# Altium schematic sheet +5V_3V3_DIGITAL.SchDoc
size B
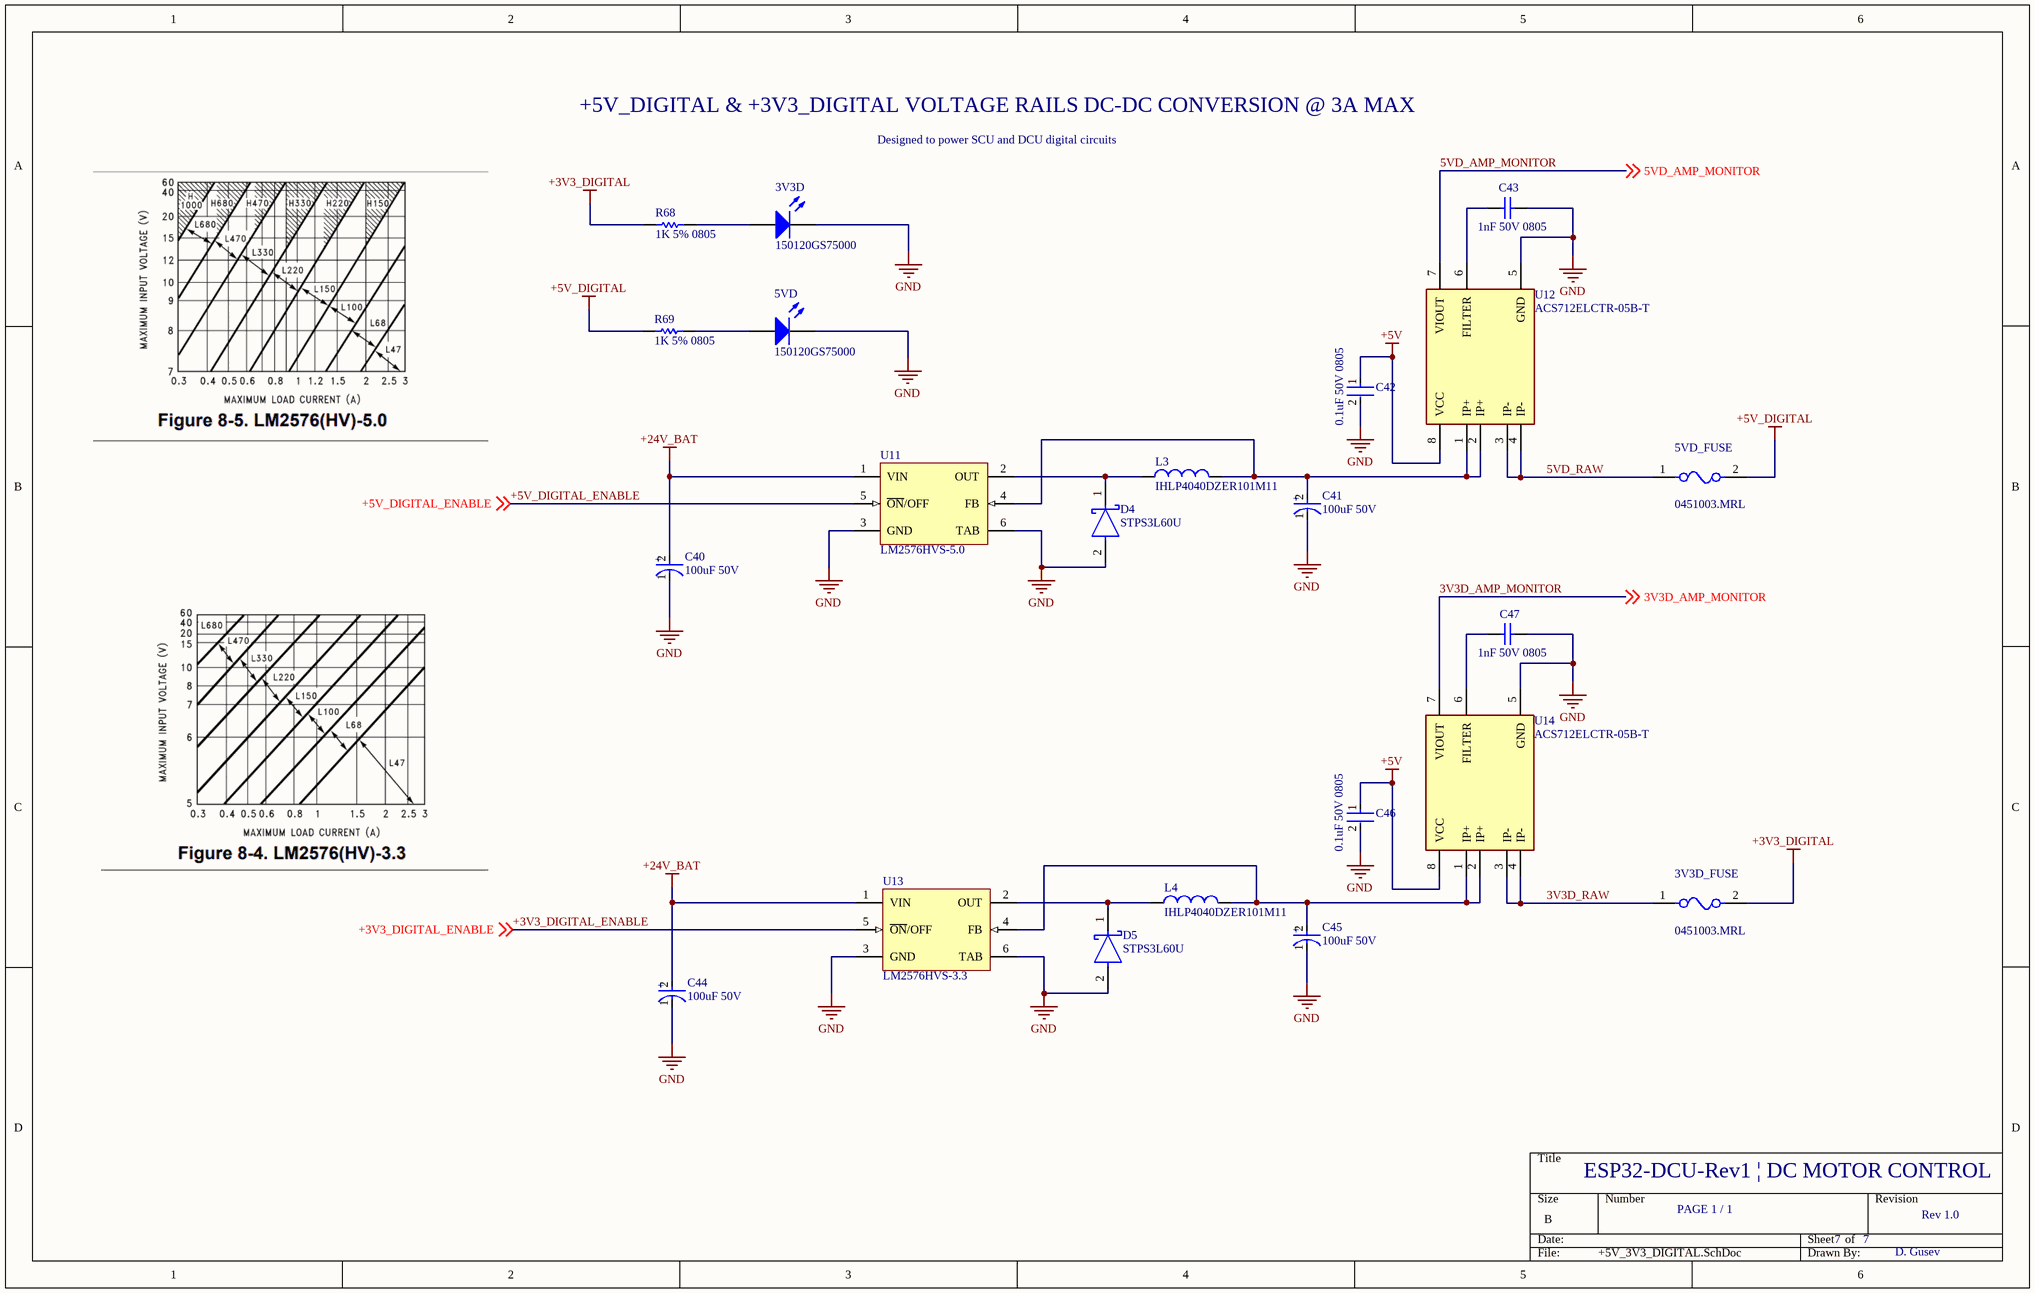
[diagram p0: +5V_3V3_DIGITAL.SchDoc]

## Parts
3V3D  150120GS75000  [1206_A]
3V3D_FUSE  0451003.MRL  [FP-0451-MFG]
5VD  150120GS75000  [1206_A]
5VD_FUSE  0451003.MRL  [FP-0451-MFG]
C40  100uF 50V  [FP-EEE-FK1H101P-MFG]
C41  100uF 50V  [FP-EEE-FK1H101P-MFG]
C42  0.1uF 50V 0805  [FP-C0805C-DN-MFG]
C43  1nF 50V 0805  [CAPC2013X94X50ML20T25]
C44  100uF 50V  [FP-EEE-FK1H101P-MFG]
C45  100uF 50V  [FP-EEE-FK1H101P-MFG]
C46  0.1uF 50V 0805  [FP-C0805C-DN-MFG]
C47  1nF 50V 0805  [CAPC2013X94X50ML20T25]
D4  STPS3L60U  [FP-SMB-MFG]
D5  STPS3L60U  [FP-SMB-MFG]
L3  IHLP4040DZER101M11  [VISH-IHLP4040DZER101M11_V]
L4  IHLP4040DZER101M11  [VISH-IHLP4040DZER101M11_V]
R68  1K 5% 0805  [RESC2013X60X40ML20T25]
R69  1K 5% 0805  [RESC2013X60X40ML20T25]
U11  LM2576HVS-5.0  [KTT0005B_L]
U12  ACS712ELCTR-05B-T  [FP-LC-8-IPC_A]
U13  LM2576HVS-3.3  [KTT0005B_M]
U14  ACS712ELCTR-05B-T  [FP-LC-8-IPC_A]

## Nets
+3V3_DIGITAL: 3V3D_FUSE.2 R68.2
+5V: C42.1 C46.1 U12.8(VCC) U14.8(VCC)
+5V_DIGITAL: 5VD_FUSE.2 R69.2
+24V_BAT: C40.2(A) C44.2(A) U11.1(VIN) U13.1(VIN)
GND: 3V3D.1(K) 5VD.1(K) C40.1(C) C41.1(C) C42.2 C43.2 C44.1(C) C45.1(C) C46.2 C47.2 D4.2(A) D5.2(A) U11.3(GND) U11.6(TAB) U12.5(GND) U13.3(GND) U13.6(TAB) U14.5(GND)
3V3D_AMP_MONITOR: U14.7(VIOUT) ; off-sheet 3V3D_AMP_MONITOR
3V3D_RAW: 3V3D_FUSE.1 U14.3(IP-) U14.4(IP-)
5VD_AMP_MONITOR: U12.7(VIOUT) ; off-sheet 5VD_AMP_MONITOR
5VD_RAW: 5VD_FUSE.1 U12.3(IP-) U12.4(IP-)
+3V3_DIGITAL_ENABLE: U13.5(~{ON}/OFF) ; off-sheet +3V3_DIGITAL_ENABLE
+5V_DIGITAL_ENABLE: U11.5(~{ON}/OFF) ; off-sheet +5V_DIGITAL_ENABLE
Net3V3D_2: 3V3D.2(A) R68.1
Net5VD_2: 5VD.2(A) R69.1
NetC41_2: C41.2(A) L3.2 U11.4(FB) U12.1(IP+) U12.2(IP+)
NetC43_1: C43.1 U12.6(FILTER)
NetC45_2: C45.2(A) L4.1 U13.4(FB) U14.1(IP+) U14.2(IP+)
NetC47_1: C47.1 U14.6(FILTER)
NetD4_1: D4.1(K) L3.1 U11.2(OUT)
NetD5_1: D5.1(K) L4.2 U13.2(OUT)

## Notes on the sheet
- +5V_DIGITAL & +3V3_DIGITAL VOLTAGE RAILS DC-DC CONVERSION @ 3A MAX
- Designed to power SCU and DCU digital circuits
- ESP32-DCU-Rev1 | DC MOTOR CONTROL
- PAGE 1 / 1
- 7
- Rev 1.0
- D. Gusev
- (in symbol CMP-2000-06208-2) +

## Library data of the parts
3V3D 5VD = CMP-1426-00014-1: SMD mono-color Chip LED, WL-SMCW, Green; Manufacturer: Wuerth Elektronik; PackageReference: 1206_A; PartNumber: 150120GS75000; ComponentLink1Description: Manufacturer URL; ComponentLink2URL: http://katalog.we-online.com/led/datasheet/150120GS75000.pdf; ComponentLink2Description: Datasheet; Color: Green; ComponentLink1URL: http://www.we-online.com
3V3D_FUSE 5VD_FUSE = CMP-08605-000063-1: FUSE BRD MNT 3A 125VAC/VDC 2SMD; Manufacturer: Littelfuse Inc; Fuse Interrupt Ac Current: 50A; Voltage Rating: 125V; Fuse I2T: 1.65A2Sec; Resistance: 0.0227Ω; Fuse Blow Speed: Fast; Value: 0.0227Ω; RoHS: TRUE; Automotive: No; Max Fuse Dc Voltage: 125V; Mouser Description: Surface Mount Fuses 125V 3A; Package: 0451; Device Class L2: Fuses; Fuse Current: 3A; Manufacturer Part Number: 0451003.MRL; ComponentLink2Description: Datasheet; Lead Free: Yes; Temperature Range Low: -55°C; Max Fuse Ac Voltage: 125V; Temperature: -55°C to +125°C; Device Class L1: Circuit Protection; Octopart: https://octopart.com/0451003.mrl-littelfuse-566380; Category: Fuse; Height: 2.94mm; Temperature Range High: +125°C; ComponentLink2URL: https://www.littelfuse.com/~/media/electronics/datasheets/fuses/littelfuse_fuse_451_453_datasheet.pdf.pdf; Digikey Description: FUSE BRD MNT 3A 125VAC/VDC 2SMD; Device Class L3: unset; Fuse Interrupt Dc Current: 50A
C40 C41 C44 C45 = CMP-2000-06208-2: CAP ALUM 100UF 20% 50V SMD; Manufacturer Part Number: EEE-FK1H101P; Manufacturer: Panasonic Electronic Components; Automotive Grade: Grade 2; Dissipation Factor: 10%; Life: 2000Hours; Ripple Current: 350mA; Material: Aluminum; Esr: 0.34Ω; Leakage Current: 50uA; Tolerance: 20%; Package: 0; ComponentLink2URL: https://industrial.panasonic.com/cdbs/www-data/pdf/RDE0000/ABA0000C1181.pdf; Temperature Range Low: -55°C; Voltage Rating: 50V; ComponentLink2Description: Datasheet; Category: Cap; Digikey Description: CAP ALUM 100UF 20% 50V SMD; Octopart: https://octopart.com/eeefk1h101p-panasonic-4642841; Automotive: Yes; Temperature: -55°C to +105°C; Capacitance: 100uF; Lead Free: Yes; Mouser Description: Cap Aluminum Lytic 100uF 50V 20% (8 X 10.2mm) SMD 350mA 2000h 105C Automotive T/R; Height: 10.5mm; Device Class L3: Aluminum Electrolytic Capacitors; Value: 100uF; Device Class L1: Passive Components; RoHS: TRUE; Device Class L2: Capacitors; Temperature Range High: +105°C
C42 C46 = CMP-2007-00279-2: CAP CER 0.1UF 50V X7R 0805; Manufacturer Part Number: C0805C104K5RACTU; Manufacturer: KEMET; Value: 0.10 μF; Tolerance: 0.1; Temperature Coefficient: 30ppm/°C; Material: Ceramic; Device Class L2: Capacitors; Temperature Range Low: -55°C; Voltage Rating: 50 V; Digikey Description: CAP CER 0.1UF 50V X7R 0805; Category: Cap; ComponentLink2Description: Datasheet; Octopart: https://octopart.com/c0805c104k5ractu-kemet-143926; RoHS: TRUE; ComponentLink2URL: https://content.kemet.com/datasheets/KEM_C1003_C0G_SMD.pdf; Temperature Characteristic: X7R; Temperature: -55°C to +125°C; Height: 0.88mm; Temperature Range High: +125°C; Device Class L1: Passive Components; Automotive: No; Lead Free: Yes; Ipc Land Pattern Name: CAPC200125X78; Device Class L3: Ceramic Capacitors; Mouser Description: Cap Ceramic 0.1uF 50V X7R 10% SMD 2.0 x 1.2 mm 125 C Paper T/R; Capacitance: 0.10 μF; Package: C0805C-DN
C43 C47 = CMP-1036-02979-2: Part Number: 08055C102KAT2A.; Manufacturer: AVX Interconnect / Elco
D4 D5 = CMP-12187-000023-1: DIODE SCHOTTKY 60V 3A SMB; Manufacturer: STMicroelectronics; Standoff Height: 0.05mm; Peak Reverse Current: 150uA; Max Junction Temp: +150°C; Max Surge Forward Current: 100A; Octopart: https://octopart.com/stps3l60u-stmicroelectronics-334329; Category: Diode; Height: 2.65mm; RoHS: TRUE; Mouser Description: Schottky diode Configuration: Single Housing type: DO-214AA=SMB Peak conducting-state current: 100 A; Forward Current: 3A; Manufacturer Part Number: STPS3L60U; Temperature: to +150°C; ComponentLink2URL: https://www.st.com/resource/en/datasheet/stps3l60.pdf; Max Repetitive Reverse Voltage: 60V; Device Class L1: Discrete Semiconductors; Automotive: No; Device Class L3: Schottky Diodes; Digikey Description: DIODE SCHOTTKY 60V 3A SMB; Lead Free: Yes; Temperature Range High: +150°C; Package: SMB; ComponentLink2Description: Datasheet; Device Class L2: Diodes
L3 L4 = CMP-2000-06447-1: Low Profile, High Current IHLP(R) Inductor, 100 uH, +/- 20%, 2.5 A, -55 to 125 degC, 2-Pin SMD, RoHS, Tape and Reel; Manufacturer: Vishay; Qualification: AEC-Q200; Test Frequency: 100kHz; Maximum DC Resistance: 270mOhms; Type: LowProfileHighCurrentIHLPInductor; Inductance: 100uH; Unit Weight: 0.070548oz; Shielding: Shielded; Brand: Vishay/Dale; Maximum DC Current: 2.25A; Termination Style: SMD/SMT; Mounting Style: SMD/SMT; Tolerance: 20%; Factory Pack Quantity: 500; Product Category: FixedInductors; Mounting Technology: SurfaceMount; Manufacturer URL: http://www.vishay.com/; Operating Temperature Range: -55Cto+125C; Datasheet Version: 08/2015; Product: PowerInductors; Packaging: Reel; Length: 10.3mm; Package Description: 2-Pin Surface Mount Device, Body 10.3 x 10.3 mm; Height: 4mm; Width: 10.3mm; Series: IHLP-4040DZ-11; RoHS: True; Package Reference: IHLP4040DZER101M11; Tradename: IHLP; Datasheet URL: http://www.vishay.com/docs/34192/lp40dz11.pdf; Package / Case: 4040
R68 R69 = CMP-2001-00590-1: Part Number: ERA6AEB123V; Manufacturer: Panasonic
U11 = CMP-0069-00141-3: SIMPLE SWITCHER® 3A Step-Down Voltage Regulator, 5-pin TO-263; Manufacturer: Texas Instruments; PackageTopMarking: NSUZXYTTE#*LM2576*HVS-5.0 P+; PowerWise: N; RoHS: N; PackageDescription: TO-263, Molded, .400 x .390 x .180in, 5 Lead, .067in Pitch, Surface Mount; Code_JEDEC: MO-169-AB; CompType: Switcher; ComponentLink1URL: http://www.ti.com/general/docs/lit/getliterature.tsp?genericPartNumber=LM2576HV&fileType=pdf; ComponentLink1Description: Datasheet URL; PinCount: 5; PackageReference: KTT0005B
U12 U14 = CMP-2000-04989-2: SENSOR CURRENT HALL 5A AC/DC; Output Current: 10mA; Response Time: 5us; Number of Channels: 1; Sensitivity: 185mV/A; Polarity: Bidirectional; Linearity: 1.5%; Max Supply Current: 13mA; Frequency: 80kHz; Max Supply Voltage: 5.5V; Min Supply Voltage: 4.5V; Voltage: 5V; Mount: Surface Mount; Max Operating Temperature: 85°C; Min Operating Temperature: -40°C; Termination: SMD/SMT; Number of Pins: 8; Accuracy: 1.5%; Current Sensing: 5A; Length: 4.9mm; Package Quantity: 1; REACH SVHC: No SVHC; Packaging: Cut Tape; Series: -; Height: 1.5mm; Width: 3.9mm; Operating Supply Voltage: 5V; Bandwidth: 80kHz; Case/Package: SOIC; Lead Free: Lead Free; Quiescent Current: 10mA; RoHS Compliant: Yes
U13 = CMP-0069-00132-3: SIMPLE SWITCHER® 3A Step-Down Voltage Regulator, 5-pin TO-263; Manufacturer: Texas Instruments; PowerWise: N; PackageTopMarking: NSUZXYTTE#*LM2576*HVS-3.3 P+; PinCount: 5; Code_JEDEC: MO-169-AB; RoHS: N; ComponentLink1URL: http://www.ti.com/general/docs/lit/getliterature.tsp?genericPartNumber=LM2576HV&fileType=pdf; ComponentLink1Description: Datasheet URL; PackageReference: KTT0005B; CompType: Switcher; PackageDescription: TO-263, Molded, .400 x .390 x .180in, 5 Lead, .067in Pitch, Surface Mount